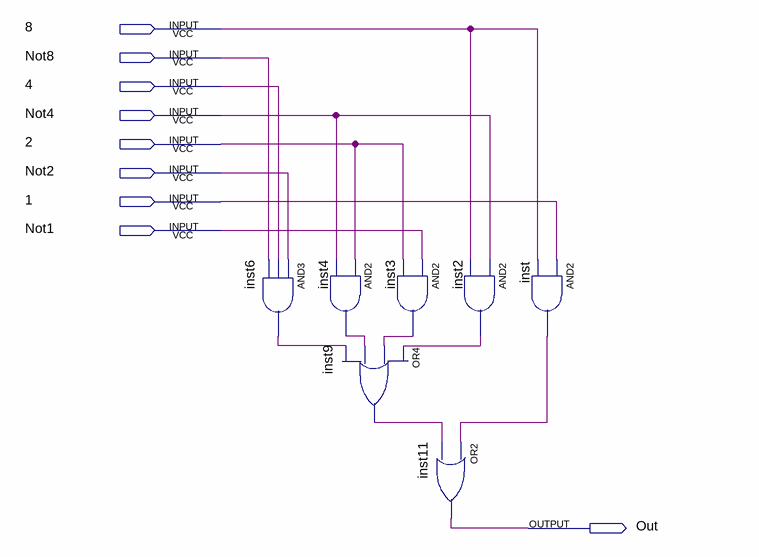
[diagram p0: schematic sheet]
// Quartus schematic G.bdf as structural Verilog: 7 symbols, 9 pins
module G (
  input  \8 ,
  input  Not8,
  input  \4 ,
  input  Not4,
  input  \2 ,
  input  Not2,
  input  \1 ,
  input  Not1,
  output Out
);

  wire inst2_out, inst3_out, inst4_out, inst6_out, inst9_out, inst_out;

  and inst6 (inst6_out, Not2, \4 , Not8);
  and inst4 (inst4_out, \2 , Not4);
  or inst9 (inst9_out, inst2_out, inst3_out, inst4_out, inst6_out);
  and inst3 (inst3_out, Not1, \2 );
  or inst11 (Out, inst_out, inst9_out);
  and inst2 (inst2_out, Not4, \8 );
  and inst (inst_out, \1 , \8 );
endmodule
